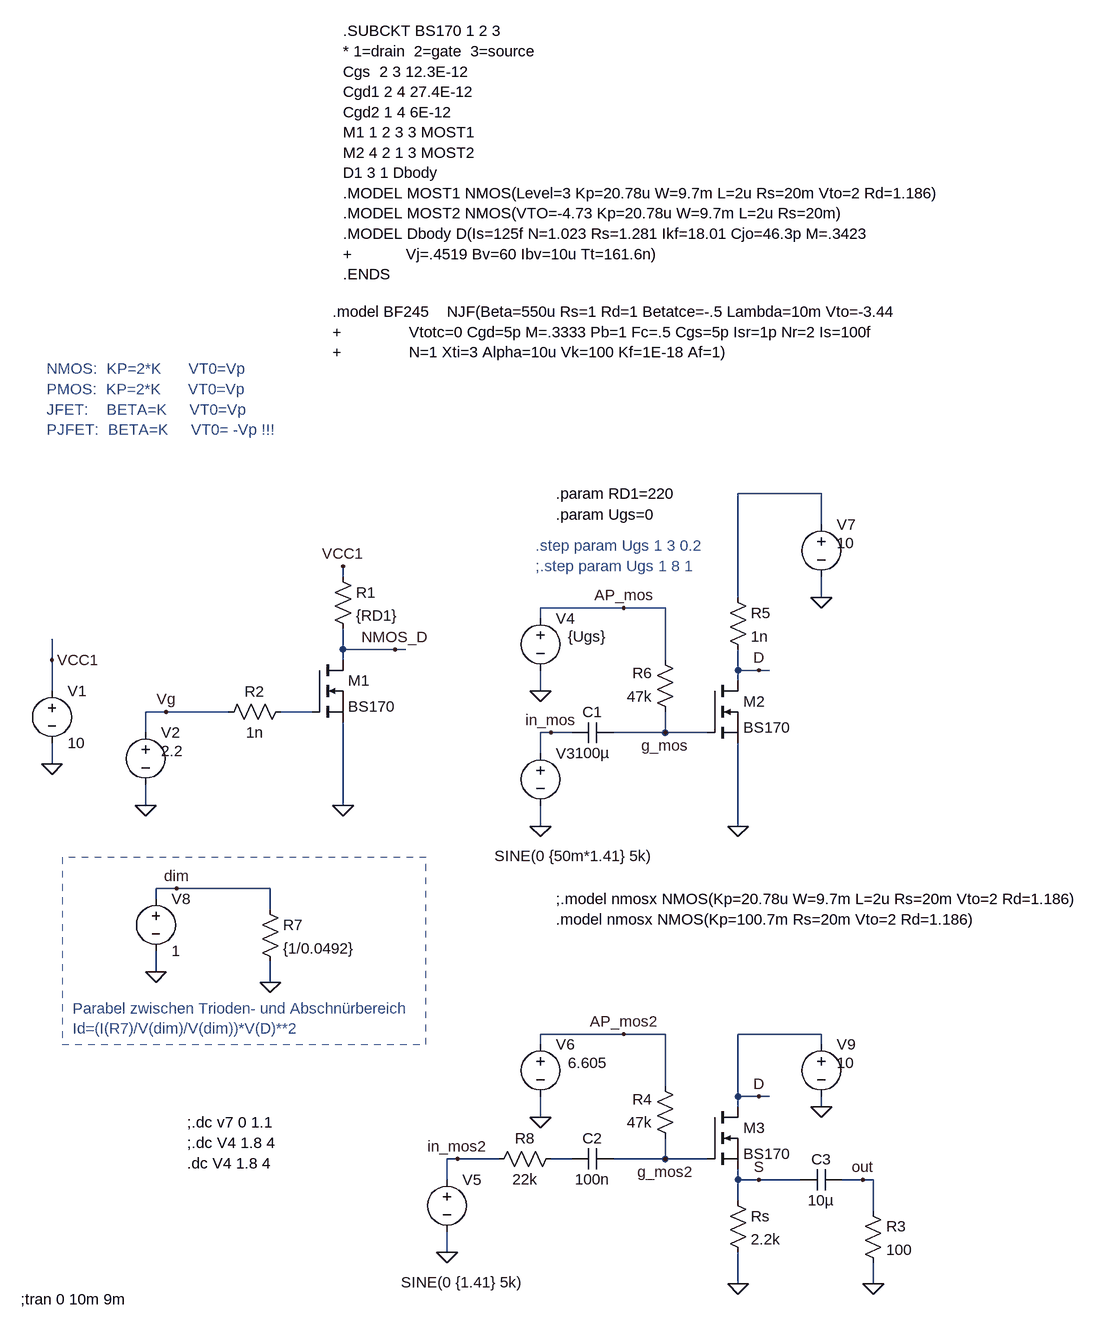
[diagram p0: schematic FET_variables_gm.asc]
FET_variables_gm.asc, the LTspice schematic file:
Version 4
SHEET 1 880 680
WIRE -2048 -2256 -2176 -2256
WIRE -2048 -2208 -2048 -2256
WIRE -2784 -2128 -2784 -2144
WIRE -2176 -2096 -2176 -2256
WIRE -2048 -2096 -2048 -2128
WIRE -2352 -2080 -2480 -2080
WIRE -2288 -2080 -2352 -2080
WIRE -2480 -2064 -2480 -2080
WIRE -2784 -2016 -2784 -2048
WIRE -2704 -2016 -2784 -2016
WIRE -2688 -2016 -2704 -2016
WIRE -3232 -2000 -3232 -2032
WIRE -2784 -2000 -2784 -2016
WIRE -2288 -2000 -2288 -2080
WIRE -2176 -1984 -2176 -2016
WIRE -2144 -1984 -2176 -1984
WIRE -2128 -1984 -2144 -1984
WIRE -2176 -1968 -2176 -1984
WIRE -3232 -1952 -3232 -2000
WIRE -2480 -1952 -2480 -1984
WIRE -3056 -1920 -3088 -1920
WIRE -2960 -1920 -3056 -1920
WIRE -2832 -1920 -2880 -1920
WIRE -3088 -1888 -3088 -1920
WIRE -2464 -1888 -2480 -1888
WIRE -2432 -1888 -2464 -1888
WIRE -2288 -1888 -2288 -1920
WIRE -2288 -1888 -2368 -1888
WIRE -2224 -1888 -2288 -1888
WIRE -2480 -1856 -2480 -1888
WIRE -3232 -1840 -3232 -1872
WIRE -3088 -1776 -3088 -1808
WIRE -2784 -1776 -2784 -1904
WIRE -2480 -1744 -2480 -1776
WIRE -2176 -1744 -2176 -1872
WIRE -3040 -1648 -3072 -1648
WIRE -2896 -1648 -3040 -1648
WIRE -3072 -1632 -3072 -1648
WIRE -2896 -1616 -2896 -1648
WIRE -3072 -1520 -3072 -1552
WIRE -2896 -1504 -2896 -1536
WIRE -2352 -1424 -2480 -1424
WIRE -2288 -1424 -2352 -1424
WIRE -2048 -1424 -2176 -1424
WIRE -2480 -1408 -2480 -1424
WIRE -2048 -1408 -2048 -1424
WIRE -2288 -1344 -2288 -1424
WIRE -2176 -1328 -2176 -1424
WIRE -2144 -1328 -2176 -1328
WIRE -2128 -1328 -2144 -1328
WIRE -2176 -1312 -2176 -1328
WIRE -2048 -1312 -2048 -1328
WIRE -2480 -1296 -2480 -1328
WIRE -2608 -1232 -2624 -1232
WIRE -2544 -1232 -2608 -1232
WIRE -2432 -1232 -2464 -1232
WIRE -2288 -1232 -2288 -1264
WIRE -2288 -1232 -2368 -1232
WIRE -2224 -1232 -2288 -1232
WIRE -2624 -1200 -2624 -1232
WIRE -2176 -1200 -2176 -1216
WIRE -2144 -1200 -2176 -1200
WIRE -2080 -1200 -2144 -1200
WIRE -1984 -1200 -2016 -1200
WIRE -1968 -1200 -1984 -1200
WIRE -2176 -1168 -2176 -1200
WIRE -1968 -1152 -1968 -1200
WIRE -2624 -1088 -2624 -1120
WIRE -2176 -1040 -2176 -1088
WIRE -1968 -1040 -1968 -1072
FLAG -2784 -1776 0
FLAG -3232 -1840 0
FLAG -3088 -1776 0
FLAG -3232 -2000 VCC1
FLAG -2784 -2144 VCC1
FLAG -3056 -1920 Vg
FLAG -2704 -2016 NMOS_D
FLAG -2176 -1744 0
FLAG -2480 -1744 0
FLAG -2480 -1952 0
FLAG -2352 -2080 AP_mos
FLAG -2288 -1888 g_mos
FLAG -2464 -1888 in_mos
FLAG -2048 -2096 0
FLAG -2144 -1984 D
FLAG -3072 -1520 0
FLAG -3040 -1648 dim
FLAG -2896 -1504 0
FLAG -2176 -1040 0
FLAG -2624 -1088 0
FLAG -2352 -1424 AP_mos2
FLAG -2288 -1232 g_mos2
FLAG -2608 -1232 in_mos2
FLAG -2048 -1312 0
FLAG -2144 -1328 D
FLAG -2144 -1200 S
FLAG -2480 -1296 0
FLAG -1968 -1040 0
FLAG -1984 -1200 out
SYMBOL voltage -3232 -1968 R0
WINDOW 123 0 0 Left 2
WINDOW 39 0 0 Left 2
SYMATTR InstName V1
SYMATTR Value 10
SYMBOL res -2800 -2144 R0
SYMATTR InstName R1
SYMATTR Value {RD1}
SYMBOL voltage -3088 -1904 R0
WINDOW 123 0 0 Left 2
WINDOW 39 0 0 Left 2
WINDOW 3 24 44 Left 2
SYMATTR Value 2.2
SYMATTR InstName V2
SYMBOL res -2864 -1936 R90
WINDOW 0 0 56 VBottom 2
WINDOW 3 32 56 VTop 2
SYMATTR InstName R2
SYMATTR Value 1n
SYMBOL nmos -2832 -2000 R0
SYMATTR InstName M1
SYMATTR Value BS170
SYMATTR Prefix X
SYMBOL res -2192 -2112 R0
SYMATTR InstName R5
SYMATTR Value 1n
SYMBOL voltage -2480 -1872 R0
WINDOW 123 0 0 Left 2
WINDOW 39 0 0 Left 2
WINDOW 3 -71 174 Left 2
SYMATTR Value SINE(0 {50m*1.41} 5k)
SYMATTR InstName V3
SYMBOL res -2272 -1904 R180
WINDOW 0 36 76 Left 2
WINDOW 3 36 40 Left 2
SYMATTR InstName R6
SYMATTR Value 47k
SYMBOL cap -2368 -1904 R90
WINDOW 0 0 32 VBottom 2
WINDOW 3 32 32 VTop 2
SYMATTR InstName C1
SYMATTR Value 100µ
SYMBOL voltage -2480 -2080 R0
WINDOW 123 0 0 Left 2
WINDOW 39 0 0 Left 2
WINDOW 3 42 44 Left 2
SYMATTR Value {Ugs}
SYMATTR InstName V4
SYMBOL nmos -2224 -1968 R0
SYMATTR InstName M2
SYMATTR Value BS170
SYMATTR Prefix x
SYMBOL voltage -2048 -2224 R0
WINDOW 123 0 0 Left 2
WINDOW 39 0 0 Left 2
WINDOW 3 24 44 Left 2
SYMATTR Value 10
SYMATTR InstName V7
SYMBOL voltage -3072 -1648 R0
WINDOW 123 0 0 Left 2
WINDOW 39 0 0 Left 2
SYMATTR InstName V8
SYMATTR Value 1
SYMBOL res -2912 -1632 R0
SYMATTR InstName R7
SYMATTR Value {1/0.0492}
SYMBOL voltage -2624 -1216 R0
WINDOW 123 0 0 Left 2
WINDOW 39 0 0 Left 2
WINDOW 3 -71 174 Left 2
SYMATTR Value SINE(0 {1.41} 5k)
SYMATTR InstName V5
SYMBOL res -2272 -1248 R180
WINDOW 0 36 76 Left 2
WINDOW 3 36 40 Left 2
SYMATTR InstName R4
SYMATTR Value 47k
SYMBOL cap -2368 -1248 R90
WINDOW 0 0 32 VBottom 2
WINDOW 3 32 32 VTop 2
SYMATTR InstName C2
SYMATTR Value 100n
SYMBOL nmos -2224 -1312 R0
SYMATTR InstName M3
SYMATTR Value BS170
SYMATTR Prefix x
SYMBOL voltage -2048 -1424 R0
WINDOW 123 0 0 Left 2
WINDOW 39 0 0 Left 2
WINDOW 3 24 44 Left 2
SYMATTR Value 10
SYMATTR InstName V9
SYMBOL res -2192 -1184 R0
SYMATTR InstName Rs
SYMATTR Value 2.2k
SYMBOL voltage -2480 -1424 R0
WINDOW 123 0 0 Left 2
WINDOW 39 0 0 Left 2
WINDOW 3 42 44 Left 2
SYMATTR Value 6.605
SYMATTR InstName V6
SYMBOL cap -2016 -1216 R90
WINDOW 0 0 32 VBottom 2
WINDOW 3 32 32 VTop 2
SYMATTR InstName C3
SYMATTR Value 10µ
SYMBOL res -1984 -1168 R0
SYMATTR InstName R3
SYMATTR Value 100
SYMBOL res -2448 -1248 R90
WINDOW 0 0 56 VBottom 2
WINDOW 3 32 56 VTop 2
SYMATTR InstName R8
SYMATTR Value 22k
TEXT -3024 -1288 Left 2 !;.dc v7 0 1.1\n;.dc V4 1.8 4\n.dc V4 1.8 4
TEXT -2456 -1632 Left 2 !;.model nmosx NMOS(Kp=20.78u W=9.7m L=2u Rs=20m Vto=2 Rd=1.186)\n.model nmosx NMOS(Kp=100.7m Rs=20m Vto=2 Rd=1.186)
TEXT -3240 -2448 Left 2 ;NMOS:  KP=2*K      VT0=Vp\nPMOS:  KP=2*K      VT0=Vp\nJFET:    BETA=K     VT0=Vp\nPJFET:  BETA=K     VT0= -Vp !!!
TEXT -2456 -2256 Left 2 !.param RD1=220
TEXT -2784 -2968 Left 2 !.SUBCKT BS170 1 2 3\n* 1=drain  2=gate  3=source\nCgs  2 3 12.3E-12\nCgd1 2 4 27.4E-12\nCgd2 1 4 6E-12\nM1 1 2 3 3 MOST1\nM2 4 2 1 3 MOST2\nD1 3 1 Dbody\n.MODEL MOST1 NMOS(Level=3 Kp=20.78u W=9.7m L=2u Rs=20m Vto=2 Rd=1.186)\n.MODEL MOST2 NMOS(VTO=-4.73 Kp=20.78u W=9.7m L=2u Rs=20m)\n.MODEL Dbody D(Is=125f N=1.023 Rs=1.281 Ikf=18.01 Cjo=46.3p M=.3423\n+            Vj=.4519 Bv=60 Ibv=10u Tt=161.6n)\n.ENDS
TEXT -2800 -2536 Left 2 !.model BF245    NJF(Beta=550u Rs=1 Rd=1 Betatce=-.5 Lambda=10m Vto=-3.44\n+               Vtotc=0 Cgd=5p M=.3333 Pb=1 Fc=.5 Cgs=5p Isr=1p Nr=2 Is=100f\n+               N=1 Xti=3 Alpha=10u Vk=100 Kf=1E-18 Af=1)
TEXT -2456 -2224 Left 2 !.param Ugs=0
TEXT -2488 -2176 Left 2 ;.step param Ugs 1 3 0.2\n;.step param Ugs 1 8 1
TEXT -3200 -1464 Left 2 ;Parabel zwischen Trioden- und Abschnürbereich \nId=(I(R7)/V(dim)/V(dim))*V(D)**2
TEXT -3280 -1016 Left 2 !;tran 0 10m 9m
LINE Normal -2656 -1696 -3216 -1696 2
LINE Normal -2656 -1408 -2656 -1696 2
LINE Normal -3216 -1408 -2656 -1408 2
LINE Normal -3216 -1696 -3216 -1408 2

The netlist it stands for:
* FET_variables_gm.asc
V1 VCC1 0 10
R1 VCC1 NMOS_D {RD1}
V2 Vg 0 2.2
R2 N002 Vg 1n
XM1 NMOS_D N002 0 BS170  ; pins D G S
R5 N001 D 1n
V3 in_mos 0 SINE(0 {50m*1.41} 5k)
R6 g_mos AP_mos 47k
C1 g_mos in_mos 100µ
V4 AP_mos 0 {Ugs}
XM2 D g_mos 0 BS170  ; pins D G S
V7 N001 0 10
V8 dim 0 1
R7 dim 0 {1/0.0492}
V5 in_mos2 0 SINE(0 {1.41} 5k)
R4 g_mos2 AP_mos2 47k
C2 g_mos2 N003 100n
XM3 D g_mos2 S BS170  ; pins D G S
V9 D 0 10
Rs S 0 2.2k
V6 AP_mos2 0 6.605
C3 out S 10µ
R3 out 0 100
R8 N003 in_mos2 22k
;.dc v7 0 1.1
;.dc V4 1.8 4
.dc V4 1.8 4
;.model nmosx NMOS(Kp=20.78u W=9.7m L=2u Rs=20m Vto=2 Rd=1.186)
.model nmosx NMOS(Kp=100.7m Rs=20m Vto=2 Rd=1.186)
* NMOS:  KP=2*K      VT0=Vp
* PMOS:  KP=2*K      VT0=Vp
* JFET:    BETA=K     VT0=Vp
* PJFET:  BETA=K     VT0= -Vp !!!
.param RD1=220
.SUBCKT BS170 1 2 3
* 1=drain  2=gate  3=source
Cgs  2 3 12.3E-12
Cgd1 2 4 27.4E-12
Cgd2 1 4 6E-12
M1 1 2 3 3 MOST1
M2 4 2 1 3 MOST2
D1 3 1 Dbody
.MODEL MOST1 NMOS(Level=3 Kp=20.78u W=9.7m L=2u Rs=20m Vto=2 Rd=1.186)
.MODEL MOST2 NMOS(VTO=-4.73 Kp=20.78u W=9.7m L=2u Rs=20m)
.MODEL Dbody D(Is=125f N=1.023 Rs=1.281 Ikf=18.01 Cjo=46.3p M=.3423
+            Vj=.4519 Bv=60 Ibv=10u Tt=161.6n)
.ENDS
.model BF245    NJF(Beta=550u Rs=1 Rd=1 Betatce=-.5 Lambda=10m Vto=-3.44
+               Vtotc=0 Cgd=5p M=.3333 Pb=1 Fc=.5 Cgs=5p Isr=1p Nr=2 Is=100f
+               N=1 Xti=3 Alpha=10u Vk=100 Kf=1E-18 Af=1)
.param Ugs=0
* .step param Ugs 1 3 0.2
* ;.step param Ugs 1 8 1
* Parabel zwischen Trioden- und Abschnürbereich
* Id=(I(R7)/V(dim)/V(dim))*V(D)**2
;tran 0 10m 9m
.backanno
.end